# Altium schematic sheet Controller.SchDoc
size A
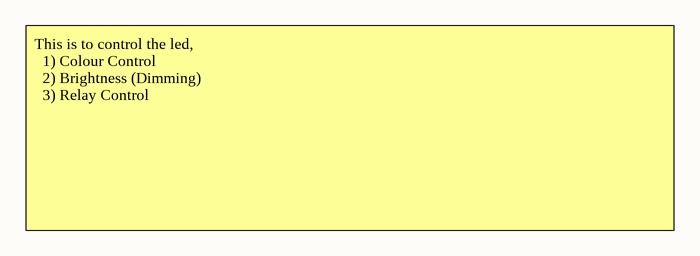
[diagram p0: Controller.SchDoc]

## Notes on the sheet
- This is to control the led,
  1) Colour Control
  2) Brightness (Dimming)
  3) Relay Control